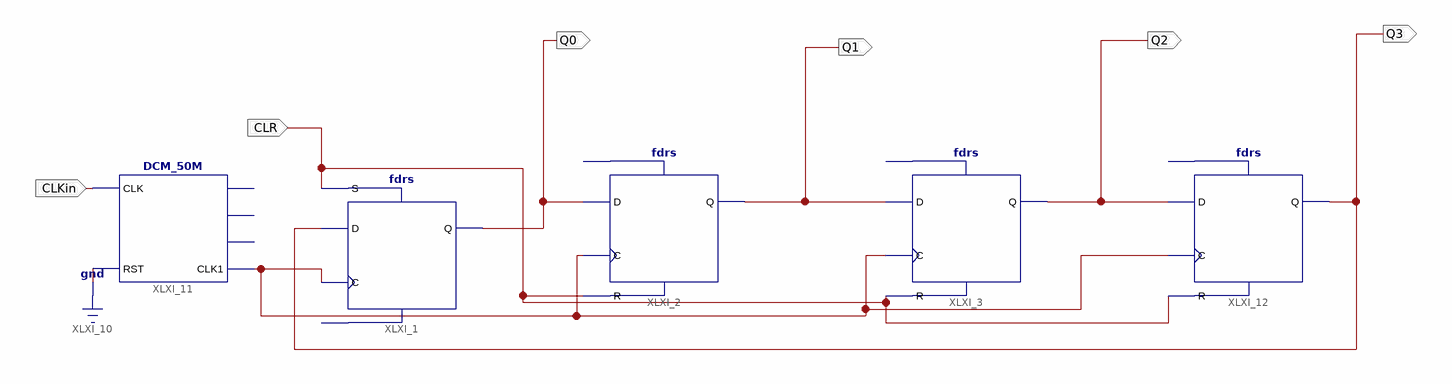
[diagram p0: schematic sheet 1]
// Xilinx ISE schematic experiment7_2.sch (spartan3e) as structural Verilog: 5 symbols, 6 ports
module experiment7_2 (
  input  CLR,
  input  CLKin,
  output Q2,
  output Q1,
  output Q0,
  output Q3
);

  wire XLXN_18;

  fdrs XLXI_1 (.C(XLXN_18), .D(Q3), .S(CLR), .Q(Q0));  // open: R
  fdrs XLXI_3 (.C(XLXN_18), .D(Q1), .R(CLR), .Q(Q2));  // open: S
  fdrs XLXI_2 (.C(XLXN_18), .D(Q0), .R(CLR), .Q(Q1));  // open: S
  DCM_50M XLXI_11 (.CLK(CLKin), .RST(1'b0), .CLK1(XLXN_18));  // open: CLK1M, CLK10k, CLK1k
  fdrs XLXI_12 (.C(XLXN_18), .D(Q2), .R(CLR), .Q(Q3));  // open: S
endmodule
